# Altium schematic sheet SmartEnergyMeter_schematic.SchDoc: Smart Energy Meter
size A4; SheetNumber: 1; SheetTotal: 1
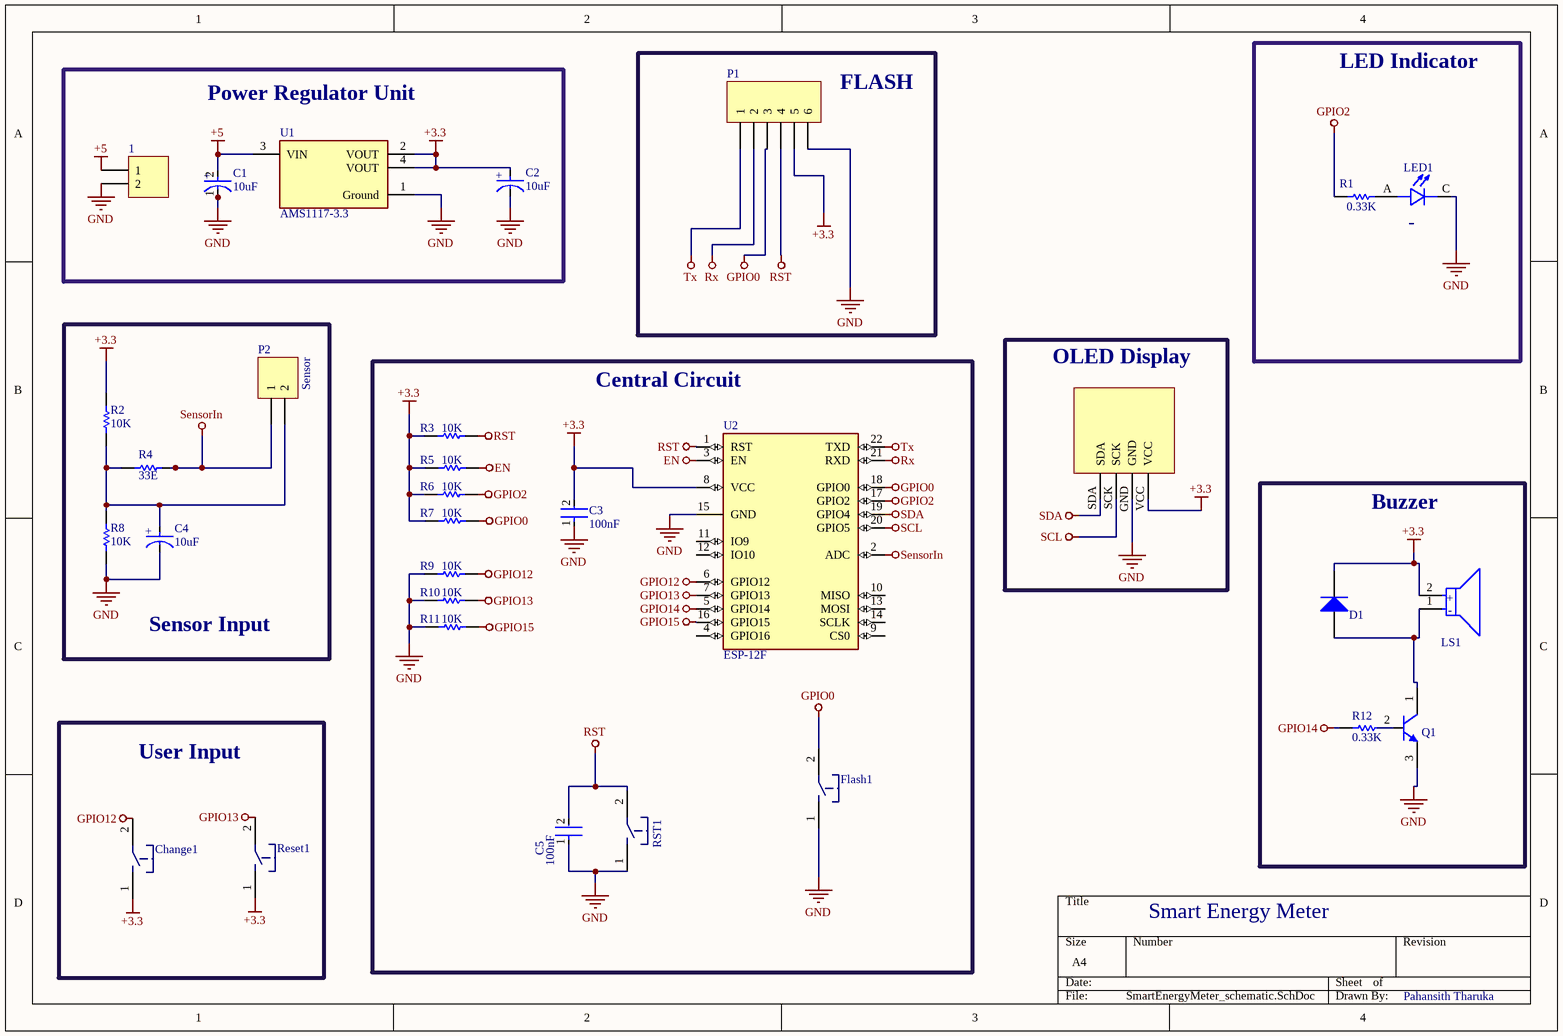
[diagram p0: SmartEnergyMeter_schematic.SchDoc]

## Parts
1  Header 3  [HDR1X2]  (value not drawn)
C1  10uF  [FP-RAD-TH-D_5_0_5-L_11_1-MFG]
C2  10uF  [FP-RAD-TH-D_5_0_5-L_11_1-MFG]
C3  100nF  [FP-C322C104K5R5TA-MFG]
C4  10uF  [FP-RAD-TH-D_5_0_5-L_11_1-MFG]
C5  100nF  [FP-C322C104K5R5TA-MFG]
Change1  Tac switch  [MY_TACTILE-PTH]  (value not drawn)
D1  1N4007  [My_DO41]  (value not drawn)
Flash1  Tac switch  [MY_TACTILE-PTH]  (value not drawn)
LED1  L08R5000Q1  [LEDRD254W57D500H1070]  (value not drawn)
LS1  SDC1610M5-01  [FP-SDC1610M5-01-MFG]  (value not drawn)
OLED_Display1  OLED Display  [PCBComponent_1]  (value not drawn)  (part E of 5)
P1  Header 6  [My_1X06]  (value not drawn)
P2  Sensor  [HDR1X2]
Q1  BC546BRL1G  [ONSC-TO-92-3-29-11_AM_BL]  (value not drawn)
R1  0.33K  [OMTE-RES7X2.5-2]
R2  10K  [OMTE-RES7X2.5-2]
R3  10K  [OMTE-RES7X2.5-2]
R4  33E  [OMTE-RES7X2.5-2]
R5  10K  [OMTE-RES7X2.5-2]
R6  10K  [OMTE-RES7X2.5-2]
R7  10K  [OMTE-RES7X2.5-2]
R8  10K  [OMTE-RES7X2.5-2]
R9  10K  [OMTE-RES7X2.5-2]
R10  10K  [OMTE-RES7X2.5-2]
R11  10K  [OMTE-RES7X2.5-2]
R12  0.33K  [OMTE-RES7X2.5-2]
Reset1  Tac switch  [MY_TACTILE-PTH]  (value not drawn)
RST1  Tac switch  [MY_TACTILE-PTH]  (value not drawn)
U1  AMS1117-3.3  [FP-AMS1117-IPC_C]
U2  ESP-12F  [ESP-12F]

## Blocks framed on the sheet
Power Regulator Unit: 1 C1 C2 U1
FLASH: P1
LED Indicator: LED1 R1
Sensor Input: C4 P2 R2 R4 R8
OLED Display: OLED_Display1
Central Circuit: C3 C5 Flash1 R3 R5-R7 R9-R11 RST1 U2
Buzzer: D1 LS1 Q1 R12
User Input: Change1 Reset1

## Nets
+3.3: C2.2(A) C3.2 Change1.1 D1.K LS1.2(A) OLED_Display1.VCC P1.5 R2.2 R3.1 R5.1 R6.2 R7.1 Reset1.1 U1.2(VOUT) U1.4(VOUT) U2.8(VCC)
+5: 1.1 C1.2(A) U1.3(VIN)
EN: R5.2 U2.3(EN)
GND: 1.2 C1.1(C) C2.1(C) C3.1 C4.1(C) C5.1 Flash1.1 LED1.C OLED_Display1.GND P1.6 Q1.3(E) R8.1 R9.2 R10.2 R11.2 RST1.1 U1.1(Ground) U2.15(GND)
GPIO0: Flash1.2 P1.3 R7.2 U2.18(GPIO0)
GPIO2: R1.1 R6.1 U2.17(GPIO2)
GPIO12: Change1.2 R9.1 U2.6(GPIO12)
GPIO13: R10.1 Reset1.2 U2.7(GPIO13)
GPIO14: R12.1 U2.5(GPIO14)
GPIO15: R11.1 U2.16(GPIO15)
RST: C5.2 P1.4 R3.2 RST1.2 U2.1(RST)
Rx: P1.2 U2.21(RXD)
SCL: OLED_Display1.SCK U2.20(GPIO5)
SDA: OLED_Display1.SDA U2.19(GPIO4)
SensorIn: P2.1 R4.1 U2.2(ADC)
Tx: P1.1 U2.22(TXD)
NetC4_2: C4.2(A) P2.2 R2.1 R4.2 R8.2
NetD1_A: D1.A LS1.1(C) Q1.1(C)
NetQ1_2: Q1.2(B) R12.2

Not connected (* = marked no-connect by the designer): LED1 A; R1 2; U2 4(GPIO16) 9(CS0) 10(MISO) 11(IO9) 12(IO10) 13(MOSI) 14(SCLK)

## Notes on the sheet
- Pahansith Tharuka
- (in symbol CMP-05427-000260-1) +
- (in symbol CMP-08413-000008-1) +; -

## Library data of the parts
1 P2 = Header 2: Header, 2-Pin; LatestRevisionDate: 17-Jul-2002; LatestRevisionNote: Re-released for DXP Platform.; Publisher: Altium Limited
C1 C2 C4 = CMP-05427-000260-1: Aluminum Electrolytic Capacitors (Radial Lead Type) AEC-Q200 Qualified 10uF ±20% 50V; Lead Diameter: 0.5mm; Polarity: Polar; Leakage Current: 3uA; Life (Hours): 1000Hour; Ripple Current: 39mA; Lead/Base Style: Straight; Max Operating Temperature: 105°C; Voltage Rating (DC): 50V; Diameter: 5mm; RoHS Compliant: Yes; Capacitance: 10uF; Packaging: Ammo Pack; Series: NHG; Construction: RADIAL; Length: 11mm; Tolerance: 20%; Height - Seated (Max): 0.472inch; Contact Plating: Tin; Height: 11mm; Min Operating Temperature: -55°C; Radiation Hardening: No; Package Quantity: 2000; Mount: Through Hole; Voltage Rating: 50V; Lead Pitch: 2.5mm; Termination: Radial; Lead Free: Lead Free; Case/Package: Radial
C3 C5 = CMP-03020-034661-1: CAP CER 0.1UF 50V X7R RADIAL; Dielectric Material: Ceramic; Dissipation Factor: 2.5%; Lead Length: 7mm; Tolerance: 10%; Lead Diameter: 0.51mm; Lead/Base Style: Formed Leads; Capacitance: 100nF; Construction: RADIAL; RoHS Compliant: Yes; Voltage Rating (DC): 50V; Packaging: Bulk; Lead Free: Lead Free; Width: 0.125inch; Lead Pitch: 5.08mm; Voltage Rating: 50V; Number of Pins: 2; Radiation Hardening: No; Material: Ceramic; REACH SVHC: No SVHC; Height - Seated (Max): 0.26inch; Case/Package: Radial; Weight: 0.0625lb; Dielectric: X7R; Min Operating Temperature: -55°C; Voltage: 50V; Series: Golden Max™; Max Operating Temperature: 125°C; Height: 3.18mm; Termination: Radial; Length: 5.08mm; Depth: 3.18mm; Package Quantity: 500; Mount: Through Hole
Change1 Flash1 Reset1 RST1 = Tac switch: small tac switch; ASiD Part Number: Tac switch-AS
D1 = 1N4007: 1 Amp Diode; ASiD Part Number: 1n4007-AS
LED1 = L08R5000Q1: LED, 5MM, ORANGE; LED / Lamp Size: 5mm / T-1 3/4; LED Colour: Orange; Typ Luminous Intensity: 4.3mcd; Viewing Angle: ...; MF: LED Technology; Value: *; SnapEDA_Link: https://www.snapeda.com/parts/L08R5000Q1/LED+Technology/view-part/?ref=snap; MP: L08R5000Q1; Check_prices: https://www.snapeda.com/parts/L08R5000Q1/LED+Technology/view-part/?ref=eda; Availability: In Stock; Price: None; Package: None
LS1 = CMP-08413-000008-1: AUDIO MAGNETIC INDICATOR 4-8V TH; Nominal Supply Voltage (DC): 5V; Input Type: DC; Max Supply Current: 30mA; Number of Terminals/Pins: 2; Frequency: 2.4kHz; Lead Free: Lead Free; Operating Supply Current: 30mA; Sensing Method: Magnetic; Termination: PC Pins; Number of Pins: 2; Mount: Through Hole; Min Operating Temperature: -10°C; Diameter: 16mm; Series: SDC; Max Operating Temperature: 70°C; Packaging: Tray; Voltage Rating: 5V; Height: 10mm
P1 = Header 6: Header, 6-Pin; ASiD Part Number: Header 6-AS
Q1 = CMP-1048-01580-1: Amplifier Transistor, NPN Silicon, 3-Pin TO-92, Pb-Free, Tape and Reel; Manufacturer: On Semiconductor; IC Continuous (A): 0.1; fT Min (MHz): 150; Polarity: NPN; ComponentLink3Description: Package Specification; PackageReference: TO-92-3-29-11_AM_BL; ComponentLink3URL: http://www.onsemi.com/pub_link/Collateral/MAC97-D.PDF; PartNumber: BC546BRL1G; DatasheetVersion: Rev. 7; PackageDescription: 3-Pin Transistor Outline, Body 4.825 x 3.685 mm, Pitch 1.27 mm; ComponentLink1URL: http://www.onsemi.com/; ComponentLink2Description: Datasheet; ComponentLink2URL: http://www.onsemi.com/pub_link/Collateral/BC546-D.PDF; RoHS: TRUE; PackageVersion: Rev. AM; Packing: Tape and Reel; Mounting Technology: Through Hole; ComponentLink1Description: Manufacturer URL
R1 R4 R12 = CMP-2000-06865-1: Little Demon(R) Carbon Composition Molded OD Series, 250 V, 10 KOhm, +/-5%, -70 to 130 degC, 2-Pin THD, RoHS, Bulk; PartNumber: OD103JE; Manufacturer: Ohmite; Resistance (Ohms): 10k; Power Rating: 0.25W; Power (Watts): 0.25W,1/4W; Tolerance: ±5%; Online Catalog: OD,OF,OASeries,LittleDemon®; Catalog Drawings: OD,OF,OASeries; EDA / CAD Models: DownloadfromAcceleratedDesigns; Mounting Technology: ThroughHole; Datasheet Version: 06/2016; RoHS Information: LittleDemon"E"SeriesMaterialDeclaration; Number of Terminations: 2; Temperature Coefficient: -; Height: -; Composition: CarbonComposition; Package Description: 2-Pin THD Resistor, Body 7 x 2.5 mm, Lead Dia. 0.6 mm; Size / Dimension: 0.098"Diax0.276"L(2.50mmx7.00mm); Category: Resistors; Manufacturer URL: http://www.ohmite.com/; Features: PulseWithstanding; Family: ThroughHoleResistors; Supplier Device Package: Axial; Package / Case: Axial; Standard Package: 100; Package Reference: RES7X2.5; Operating Temperature: -; Series: LittleDemon®OD; Datasheet URL: http://www.ohmite.com/cat/res_od_of_oa.pdf; Packaging: Bulk
R2 R3 R5-R11 = CMP-2000-06865-1: Little Demon(R) Carbon Composition Molded OD Series, 250 V, 10 KOhm, +/-5%, -70 to 130 degC, 2-Pin THD, RoHS, Bulk; PartNumber: OD103JE; Manufacturer: Ohmite; Power Rating: 0.25W; Power (Watts): 0.25W,1/4W; Tolerance: ±5%; Online Catalog: OD,OF,OASeries,LittleDemon®; Catalog Drawings: OD,OF,OASeries; EDA / CAD Models: DownloadfromAcceleratedDesigns; Mounting Technology: ThroughHole; Datasheet Version: 06/2016; RoHS Information: LittleDemon"E"SeriesMaterialDeclaration; Number of Terminations: 2; Temperature Coefficient: -; Height: -; Resistance (Ohms): 10k; Composition: CarbonComposition; Package Description: 2-Pin THD Resistor, Body 7 x 2.5 mm, Lead Dia. 0.6 mm; Size / Dimension: 0.098"Diax0.276"L(2.50mmx7.00mm); Category: Resistors; Manufacturer URL: http://www.ohmite.com/; Features: PulseWithstanding; Family: ThroughHoleResistors; Supplier Device Package: Axial; Package / Case: Axial; Standard Package: 100; Package Reference: RES7X2.5; Operating Temperature: -; Series: LittleDemon®OD; Datasheet URL: http://www.ohmite.com/cat/res_od_of_oa.pdf; Packaging: Bulk
U1 = CMP-209535-000001-1: LDO Voltage Regulators 1A, 3.3V; Manufacturer: Advanced Monolithic Systems; Dropout Voltage: 1.1V; Output Type: Fixed; Nominal Supply Current: 5mA; Max Power Dissipation: 1.2W; Max Supply Voltage: 15V; Number Of Outputs: 1; Standoff Height: 0.64mm; Max Junction Temp: +125°C; Height: 1.8mm; Package: AMS1117; Device Class L2: Power Management ICs; ComponentLink2Description: Datasheet; ComponentLink2URL: http://www.advanced-monolithic.com/pdf/ds1117.pdf; Category: IC; RoHS: TRUE; Automotive: No; Device Class L1: Integrated Circuits (ICs); Output Current: 1A; Device Class L3: Voltage Regulators - Linear; Temperature: -40°C to +125°C; Output Voltage: 3.3V; Manufacturer Part Number: AMS1117-3.3; Temperature Range Low: -40°C; Octopart: https://octopart.com/ams1117-3.3-advanced+monolithic+systems-25899300; Lead Free: Yes; Ipc Land Pattern Name: SOT229P700X180-4; Temperature Range High: +125°C
U2 = ESP-12F: WiFi Module; MF: AI-Thinker; Price: None; SnapEDA_Link: https://www.snapeda.com/parts/ESP-12F/AI-Thinker/view-part/6648243/?ref=snap; Check_prices: https://www.snapeda.com/parts/ESP-12F/AI-Thinker/view-part/6648243/?ref=eda; Availability: No availability data; Value: *; MP: ESP-12F; Package: Package